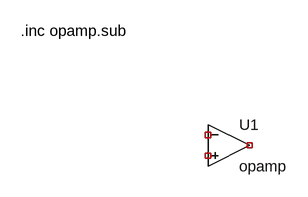
[diagram p0: schematic Draft5.asc]
Draft5.asc, the LTspice schematic file:
Version 4
SHEET 1 880 680
SYMBOL OpAmps\\opamp 208 128 R0
SYMATTR InstName U1
TEXT -112 16 Left 2 !.inc opamp.sub

The netlist it stands for:
* Draft5.asc
XU1 NC_01 NC_02 NC_03 opamp Aol=100K GBW=10Meg  ; pins invin noninvin out
.inc opamp.sub
.backanno
.end